# Altium project PCB_Project.PrjPcb
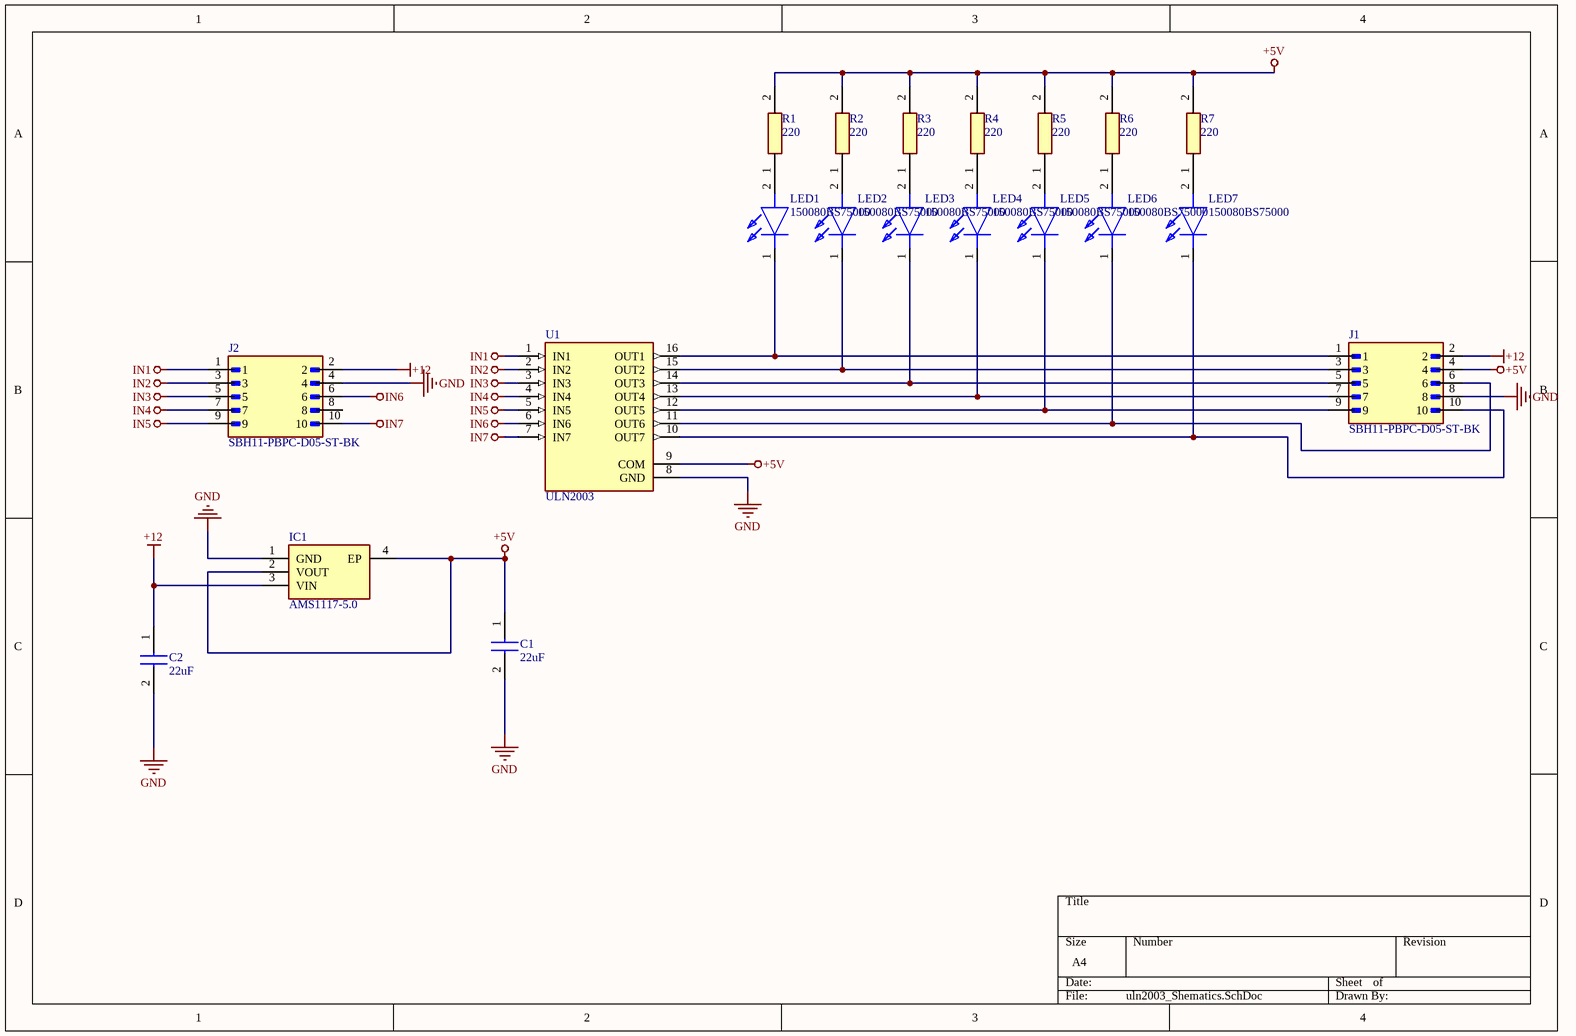
[diagram p0: uln2003_Shematics.SchDoc]
1 sheet, 20 parts. Net scope: global (net labels, ports and power ports of the same name join across sheets).
Board files: uln2003_PCB.PcbDoc, uln2003_PCB.PcbDoc

## Sheet uln2003_Shematics.SchDoc
size A4

### Parts
C1  22uF  [CAPC2013X140N]
C2  22uF  [CAPC2013X140N]
IC1  AMS1117-5.0  [SOT229P700X180-4N]
J1  SBH11-PBPC-D05-ST-BK  [SULLINS_SBH11-PBPC-D05-ST-BK]
J2  SBH11-PBPC-D05-ST-BK  [SULLINS_SBH11-PBPC-D05-ST-BK]
LED1  150080BS75000  [LEDC2012X80N]
LED2  150080BS75000  [LEDC2012X80N]
LED3  150080BS75000  [LEDC2012X80N]
LED4  150080BS75000  [LEDC2012X80N]
LED5  150080BS75000  [LEDC2012X80N]
LED6  150080BS75000  [LEDC2012X80N]
LED7  150080BS75000  [LEDC2012X80N]
R1  220  [RESC2012X65N]
R2  220  [RESC2012X65N]
R3  220  [RESC2012X65N]
R4  220  [RESC2012X65N]
R5  220  [RESC2012X65N]
R6  220  [RESC2012X65N]
R7  220  [RESC2012X65N]
U1  ULN2003  [SOIC127P600X175-16N]

### Nets
+5V: C1.1(C1) IC1.2(VOUT) IC1.4(EP) J1.4 R1.2 R2.2 R3.2 R4.2 R5.2 R6.2 R7.2 U1.9(COM)
+12: C2.1(C1) IC1.3(VIN) J1.2 J2.2
GND: C1.2(C2) C2.2(C2) IC1.1(GND) J1.8 J2.4 U1.8(GND)
IN1: J2.1 U1.1(IN1)
IN2: J2.3 U1.2(IN2)
IN3: J2.5 U1.3(IN3)
IN4: J2.7 U1.4(IN4)
IN5: J2.9 U1.5(IN5)
IN6: J2.6 U1.6(IN6)
IN7: J2.10 U1.7(IN7)
NetJ1_1: J1.1 LED1.1(K) U1.16(OUT1)
NetJ1_3: J1.3 LED2.1(K) U1.15(OUT2)
NetJ1_5: J1.5 LED3.1(K) U1.14(OUT3)
NetJ1_6: J1.6 LED6.1(K) U1.11(OUT6)
NetJ1_7: J1.7 LED4.1(K) U1.13(OUT4)
NetJ1_9: J1.9 LED5.1(K) U1.12(OUT5)
NetJ1_10: J1.10 LED7.1(K) U1.10(OUT7)
NetLED1_2: LED1.2(A) R1.1
NetLED2_2: LED2.2(A) R2.1
NetLED3_2: LED3.2(A) R3.1
NetLED4_2: LED4.2(A) R4.1
NetLED5_2: LED5.2(A) R5.1
NetLED6_2: LED6.2(A) R6.1
NetLED7_2: LED7.2(A) R7.1

Not connected (* = marked no-connect by the designer): J2 8

### Library data of the parts
C1 C2 = 08053C474JAT2A: Capacitor; Manufacturer_Name: Kyocera AVX; Manufacturer_Part_Number: 08053C474JAT2A; Mouser Part Number: 581-08053C474JAT2A; Mouser Price/Stock: https://www.mouser.co.uk/ProductDetail/KYOCERA-AVX/08053C474JAT2A?qs=bb%252B1MDm7h6L8wnHciIrwGg%3D%3D
IC1 = AMS1117-5.0: Integrated Circuit; Manufacturer_Name: Shikues; Datasheet Link: https://datasheet.lcsc.com/szlcsc/SK-AMS1117-5-0_C165483.pdf; Height: 1.8mm; Manufacturer_Part_Number: AMS1117-5.0
J1 J2 = SBH11-PBPC-D05-ST-BK: 10 Position Total Dual Row 2.54 mm Pitch Straight Male Shrouded Box Header; MF: Sullins Connector; SnapEDA_Link: https://www.snapeda.com/parts/SBH11-PBPC-D05-ST-BK/Sullins+Connector+Solutions/view-part/?ref=snap; Package: None; Value: *; MP: SBH11-PBPC-D05-ST-BK; Check_prices: https://www.snapeda.com/parts/SBH11-PBPC-D05-ST-BK/Sullins+Connector+Solutions/view-part/?ref=eda
LED1-LED7 = 150080BS75000: LED; Manufacturer_Name: Wurth Elektronik; Datasheet Link: https://katalog.we-online.com/led/datasheet/150080BS75000.pdf; Height: 0.8mm; Manufacturer_Part_Number: 150080BS75000; Mouser Part Number: 710-150080BS75000; Mouser Price/Stock: https://www.mouser.co.uk/ProductDetail/Wurth-Elektronik/150080BS75000?qs=2kOmHSv6VfT2tBo3UPVqAQ%3D%3D
R1-R7 = CPF0805B102RE1: Resistor; Manufacturer_Name: TE Connectivity; Datasheet Link: http://docs-europe.electrocomponents.com/webdocs/13d1/0900766b813d116f.pdf; Height: 0.65mm; Manufacturer_Part_Number: CPF0805B102RE1
U1 = ULN2003: Bipolar (BJT) Transistor Array 7 NPN Darlington 50V 500mA - - Surface Mount 16-SOIC; MF: Texas Instruments; Check_prices: https://www.snapeda.com/parts/ULN2003/Texas+Instruments/view-part/?ref=eda; Package: SOIC-16 National Semiconductor; Availability: Not in stock; Value: *; MP: ULN2003; SnapEDA_Link: https://www.snapeda.com/parts/ULN2003/Texas+Instruments/view-part/?ref=snap; Price: None